# EasyEDA Pro project DRV8701E_V1.0.eprj

# Schematic DRV8701E
Create Date: 2023-04-21; Page Name: P1; Project Name: DRV8701E_V1.0; Schematic Name: DRV8701E; Update Date: 2023-04-21; Company: 嘉立创EDA; Page Size: A4; Version: V1.0
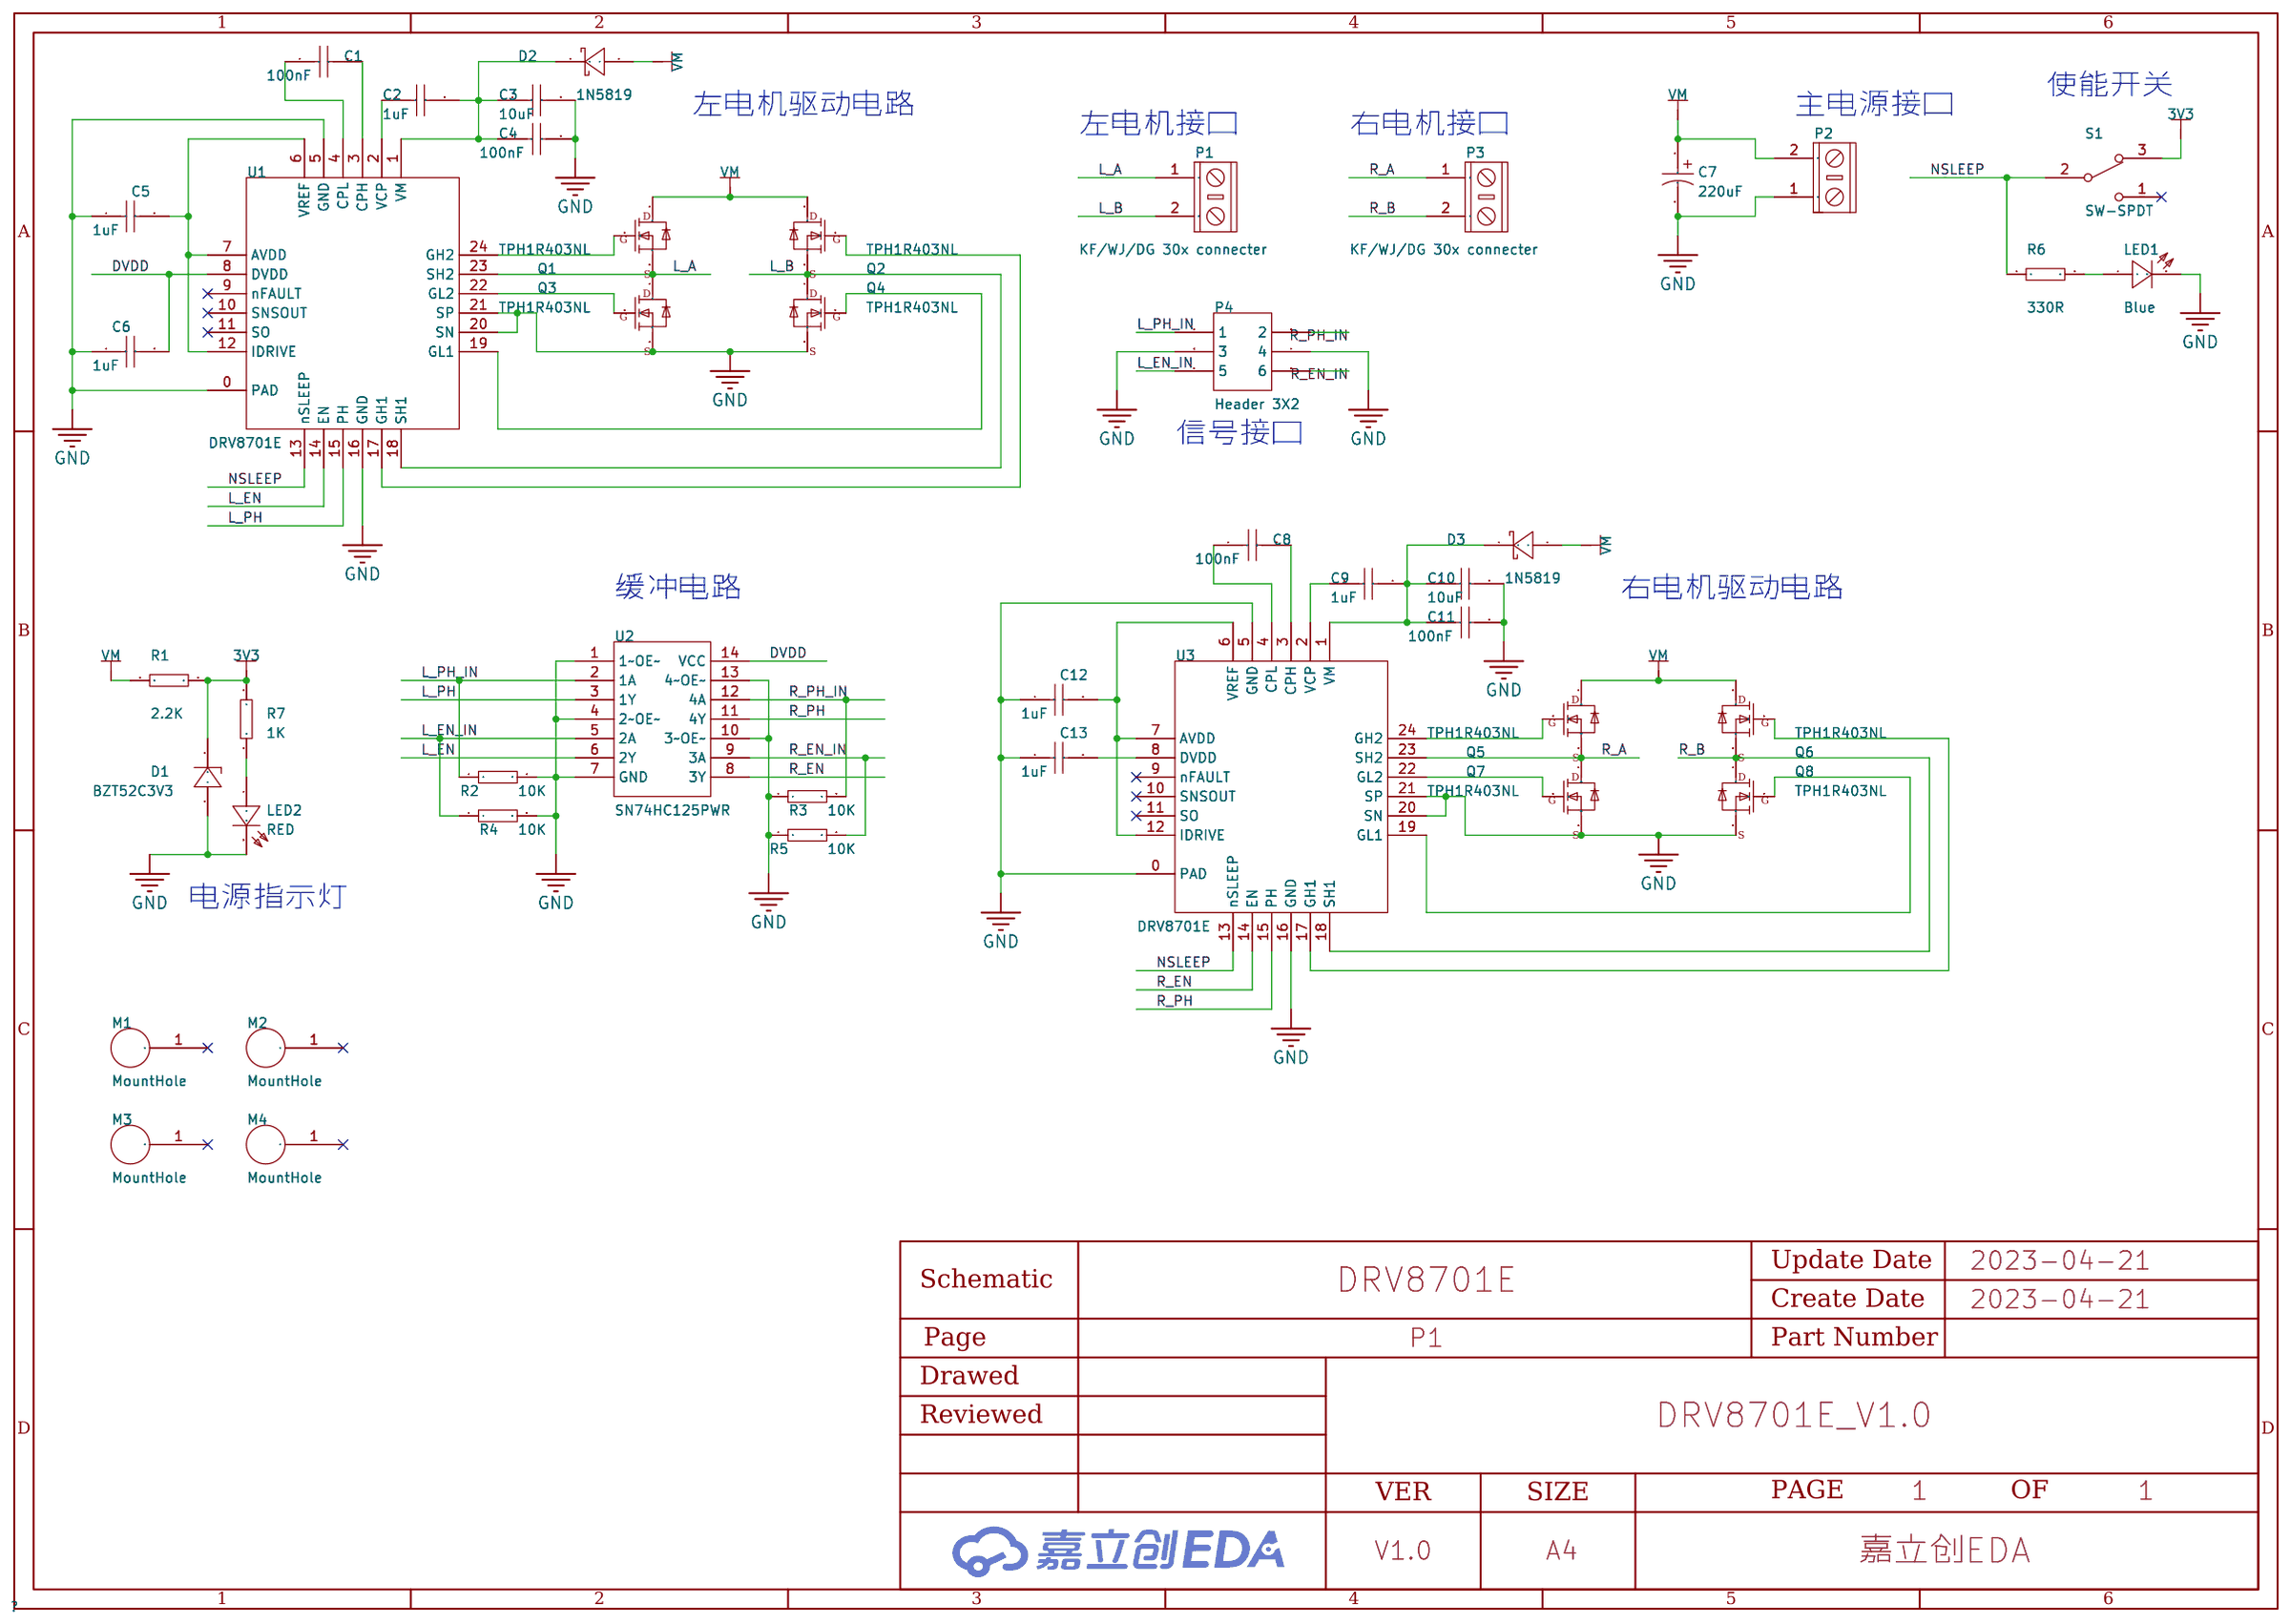
[diagram p0: schematic sheet]

## Parts
C1  100nF  [CAPC1608[0603]S-N]
C2  1uF  [CAPC1608[0603]S-N]
C3  10uF  [CAPC2012[0805]S-N]
C4  100nF  [CAPC1608[0603]S-N]
C5  1uF  [CAPC1608[0603]S-N]
C6  1uF  [CAPC1608[0603]S-N]
C7  220uF  [CAPPR3.5-8X11.5]
C8  100nF  [CAPC1608[0603]S-N]
C9  1uF  [CAPC1608[0603]S-N]
C10  10uF  [CAPC2012[0805]S-N]
C11  100nF  [CAPC1608[0603]S-N]
C12  1uF  [CAPC1608[0603]S-N]
C13  1uF  [CAPC1608[0603]S-N]
D1  BZT52C3V3  [SOD-123-L]
D2  1N5819  [SOD-123-L]
D3  1N5819  [SOD-123-L]
LED1  Blue  [LEDC1608(0603)]
LED2  RED  [LEDC1608(0603)]
M1  MountHole  [M3-MountSlot]
M2  MountHole  [M3-MountSlot]
M3  MountHole  [M3-MountSlot]
M4  MountHole  [M3-MountSlot]
P1  KF/WJ/DG 30x connecter  [KF/WJ/DG 301-2p-5.0mm]
P2  KF/WJ/DG 30x connecter  [KF/WJ/DG 301-2p-5.0mm]
P3  KF/WJ/DG 30x connecter  [KF/WJ/DG 301-2p-5.0mm]
P4  Header 3X2  [HDR2X3]
Q1  TPH1R403NL  [DFN5x6]
Q2  TPH1R403NL  [DFN5x6]
Q3  TPH1R403NL  [DFN5x6]
Q4  TPH1R403NL  [DFN5x6]
Q5  TPH1R403NL  [DFN5x6]
Q6  TPH1R403NL  [DFN5x6]
Q7  TPH1R403NL  [DFN5x6]
Q8  TPH1R403NL  [DFN5x6]
R1  2.2K  [RESC1608[0603]S-N]
R2  10K  [RESC1608[0603]S-N]
R3  10K  [RESC1608[0603]S-N]
R4  10K  [RESC1608[0603]S-N]
R5  10K  [RESC1608[0603]S-N]
R6  330R  [RESC1608[0603]S-N]
R7  1K  [RESC1608[0603]S-N]
S1  SW-SPDT  [SS12D10]
U1  DRV8701E  [QFN24-4x4]
U2  SN74HC125PWR  [TSSOP-14]
U3  DRV8701E  [QFN24-4x4]

## Library data of the parts
C1 C4 C8 C11 = Cap-Chip_1: Published: 8-Jun-2000; Revision: July-2002: Re-released for DXP Platform.; Publisher: Altium Limited; Price(RMB): 0.000; Voltage: 50V; Tolerance: ±10%; Origin Footprint 2: CAPC1310[0504]S; Origin Footprint 3: CAPC3216[1206]S; Origin Footprint 4: CAPC3225[1210]S; Origin Footprint 5: CAPC4532[1812]S; Origin Footprint 6: CAPC4564[1825]S; Origin Footprint 7: CAPC2012[0805]; Origin Footprint 8: CAPC3216[1206]; Origin Footprint 9: CAPC3225[1210]; Origin Footprint 10: CAPC4532[1812]; Origin Footprint 11: CAPC4564[1825]; Origin Footprint 12: CAPC1608[0603]-N; Origin Footprint 13: CAPC1608[0603]-L; Origin Footprint 14: CAPC1608[0603]-M; Origin Footprint 15: CAPC1608[0603]S-L; Origin Footprint 16: CAPC1608[0603]S-M; Origin Footprint 17: CAPC1005[0402]-L; Origin Footprint 18: CAPC1005[0402]-M; Origin Footprint 19: CAPC1005[0402]-N; Origin Footprint 20: CAPC1005[0402]S-L; Origin Footprint 21: CAPC1005[0402]S-M; Origin Footprint 22: CAPC1005[0402]S-N; Origin Footprint 23: CAPC2012[0805]S-L; Origin Footprint 24: CAPC2012[0805]S-M; Origin Footprint 25: CAPC2012[0805]S-N
C2 C5 C6 C9 C12 C13 = Cap-Chip_2: Published: 8-Jun-2000; Revision: July-2002: Re-released for DXP Platform.; Publisher: Altium Limited; Price(RMB): 0.000; Voltage: 25V; Tolerance: ±10%; Origin Footprint 2: CAPC1310[0504]S; Origin Footprint 3: CAPC3216[1206]S; Origin Footprint 4: CAPC3225[1210]S; Origin Footprint 5: CAPC4532[1812]S; Origin Footprint 6: CAPC4564[1825]S; Origin Footprint 7: CAPC2012[0805]; Origin Footprint 8: CAPC3216[1206]; Origin Footprint 9: CAPC3225[1210]; Origin Footprint 10: CAPC4532[1812]; Origin Footprint 11: CAPC4564[1825]; Origin Footprint 12: CAPC1608[0603]-N; Origin Footprint 13: CAPC1608[0603]-L; Origin Footprint 14: CAPC1608[0603]-M; Origin Footprint 15: CAPC1608[0603]S-L; Origin Footprint 16: CAPC1608[0603]S-M; Origin Footprint 17: CAPC1005[0402]-L; Origin Footprint 18: CAPC1005[0402]-M; Origin Footprint 19: CAPC1005[0402]-N; Origin Footprint 20: CAPC1005[0402]S-L; Origin Footprint 21: CAPC1005[0402]S-M; Origin Footprint 22: CAPC1005[0402]S-N; Origin Footprint 23: CAPC2012[0805]S-L; Origin Footprint 24: CAPC2012[0805]S-M; Origin Footprint 25: CAPC2012[0805]S-N
C3 C10 = Cap-Chip: Published: 8-Jun-2000; Revision: July-2002: Re-released for DXP Platform.; Publisher: Altium Limited; Price(RMB): 0.000; Voltage: 25V; Tolerance: ±10%; Origin Footprint 2: CAPC1310[0504]S; Origin Footprint 3: CAPC3216[1206]S; Origin Footprint 4: CAPC3225[1210]S; Origin Footprint 5: CAPC4532[1812]S; Origin Footprint 6: CAPC4564[1825]S; Origin Footprint 7: CAPC2012[0805]; Origin Footprint 8: CAPC3216[1206]; Origin Footprint 9: CAPC3225[1210]; Origin Footprint 10: CAPC4532[1812]; Origin Footprint 11: CAPC4564[1825]; Origin Footprint 12: CAPC1608[0603]-N; Origin Footprint 13: CAPC1608[0603]-L; Origin Footprint 14: CAPC1608[0603]-M; Origin Footprint 15: CAPC1608[0603]S-L; Origin Footprint 16: CAPC1608[0603]S-M; Origin Footprint 17: CAPC1608[0603]S-N; Origin Footprint 18: CAPC1005[0402]-L; Origin Footprint 19: CAPC1005[0402]-M; Origin Footprint 20: CAPC1005[0402]-N; Origin Footprint 21: CAPC1005[0402]S-L; Origin Footprint 22: CAPC1005[0402]S-M; Origin Footprint 23: CAPC1005[0402]S-N; Origin Footprint 24: CAPC2012[0805]S-L; Origin Footprint 25: CAPC2012[0805]S-M
C7 = Cap-Elect: Published: 8-Jun-2000; Revision: July-2002: Re-released for DXP Platform.; Publisher: Altium Limited; Price(RMB): 0.000; Voltage: 25V; Origin Footprint 2: CAPPR2-4x6.8; Origin Footprint 3: CAPPR2-5X5; Origin Footprint 4: CAPPR2-5X6.8; Origin Footprint 5: CAPPR2-5X7; Origin Footprint 6: CAPPR2-5X11; Origin Footprint 7: CAPPR2-5X11.5; Origin Footprint 8: CAPPR2-5X15; Origin Footprint 9: CAPPR2.5-6.3X5; Origin Footprint 10: CAPPR2.5-6.3X5/h.9; Origin Footprint 11: CAPPR2.5-6.3X6.8; Origin Footprint 12: CAPPR2.5-6.3X6.8/h.9; Origin Footprint 13: CAPPR2.5-6.3X7; Origin Footprint 14: CAPPR2.5-6.3X11; Origin Footprint 15: CAPPR2.5-6.3X11.5; Origin Footprint 16: CAPPR2.5-6.3X15; Origin Footprint 17: CAPPR2.5-6.3x9.8; Origin Footprint 18: CAPPR2.5-8X9.8; Origin Footprint 19: CAPPR2.5-8X11; Origin Footprint 20: CAPPR2.5-8x5; Origin Footprint 21: CAPPR3.05-3.81X6.35; Origin Footprint 22: CAPPR3.5-8X5/h.9; Origin Footprint 23: CAPPR3.5-8X10.5; Origin Footprint 24: CAPPR3.5-8X12; Origin Footprint 25: CAPPR3.5-8X15; Origin Footprint 26: CAPPR3.5-8X20; Origin Footprint 27: CAPPR3.5-8x5; Origin Footprint 28: CAPPR5-8X5; Origin Footprint 29: CAPPR5-8X11.5; Origin Footprint 30: CAPPR5-8X12; Origin Footprint 31: CAPPR5-8X15; Origin Footprint 32: CAPPR5-8X20; Origin Footprint 33: CAPPR5-10X5/H.9; Origin Footprint 34: CAPPR5-10X10.5; Origin Footprint 35: CAPPR5-10X12.5; Origin Footprint 36: CAPPR5-10X16; Origin Footprint 37: CAPPR5-10X20/H1.1; Origin Footprint 38: CAPPR5-10X25; Origin Footprint 39: CAPPR5-10X30; Origin Footprint 40: CAPPR5-10x5; Origin Footprint 41: CAPPR5-10x20; Origin Footprint 42: CAPPR2.5-6.3X6.8-L
D1 = Diode Zen: Published: 8-Jun-2000; Revision: July-2002: Re-released for DXP Platform.; Publisher: Altium Limited; Price(RMB): 0.000; Origin Footprint 2: DIODE-0.7; Origin Footprint 3: DIODE-0.4; Origin Footprint 4: SOD-87[LL-41]; Origin Footprint 5: CD4521-1808; Origin Footprint 6: SOD-80[LL-34]
D2 D3 = Diode Schottky: Published: 8-Jun-2000; Revision: July-2002: Re-released for DXP Platform.; Publisher: Altium Limited; Price(RMB): 0.000; Imax: 500mA; Origin Footprint 2: SMB[DO-214AA]; Origin Footprint 3: SMC[DO-214AB]; Origin Footprint 4: SOD-123; Origin Footprint 5: SOD-323; Origin Footprint 6: SOD-523; Origin Footprint 7: SMA[DO-214AC]; Origin Footprint 8: SOD-523-L
LED1 = LED Chip Blue: Published: 8-Jun-2000; Revision: July-2002: Re-released for DXP Platform.; Publisher: Altium Limited; Price(RMB): 0.00; Origin Footprint 2: LEDC2012(0805); Origin Footprint 3: LEDC3216(1206)
LED2 = LED Chip Red: Published: 8-Jun-2000; Revision: July-2002: Re-released for DXP Platform.; Publisher: Altium Limited; Price(RMB): 0.00; Origin Footprint 2: LEDC2012(0805); Origin Footprint 3: LEDC3216(1206)
M1-M4 = MountHole: Origin Footprint 2: M3-MountHole
P1-P3 = KF/WJ/DG 30x
P4 = Header 3X2: LatestRevisionDate: 17-Jul-2002; LatestRevisionNote: Re-released for DXP Platform.; Publisher: Altium Limited; Price(RMB): 0.00; Origin Footprint 2: HDR2X3-M-SMT
Q1-Q8 = TPH1R403NL
R1 = Res-Chip: Published: 8-Jun-2000; Revision: July-2002: Re-released for DXP Platform.; Publisher: Altium Limited; Price(RMB): 0.000; Tolerance: ±1%; Origin Footprint 2: RESC2012[0805]S; Origin Footprint 3: RESC3216[1206]S; Origin Footprint 4: RESC3225[1210]S; Origin Footprint 5: RESC5025[2010]S; Origin Footprint 6: RESC6332[2512]S; Origin Footprint 7: RESC5025[2010]; Origin Footprint 8: RESC6332[2512]; Origin Footprint 9: RESC3225[1210]; Origin Footprint 10: RESC3216[1206]; Origin Footprint 11: RESC2012[0805]; Origin Footprint 12: RESC1608[0603]-M; Origin Footprint 13: RESC1608[0603]-L; Origin Footprint 14: RESC1608[0603]-N; Origin Footprint 15: RESC1608[0603]S-L; Origin Footprint 16: RESC1608[0603]S-M; Origin Footprint 17: RESC1005[0402]-L; Origin Footprint 18: RESC1005[0402]-N; Origin Footprint 19: RESC1005[0402]-M; Origin Footprint 20: RESC1005[0402]S-L; Origin Footprint 21: RESC1005[0402]S-M; Origin Footprint 22: RESC1005[0402]S-N
R2-R5 = Res-Chip_1: Published: 8-Jun-2000; Revision: July-2002: Re-released for DXP Platform.; Publisher: Altium Limited; Price(RMB): 0.000; Tolerance: ±1%; Origin Footprint 2: RESC2012[0805]S; Origin Footprint 3: RESC3216[1206]S; Origin Footprint 4: RESC3225[1210]S; Origin Footprint 5: RESC5025[2010]S; Origin Footprint 6: RESC6332[2512]S; Origin Footprint 7: RESC5025[2010]; Origin Footprint 8: RESC6332[2512]; Origin Footprint 9: RESC3225[1210]; Origin Footprint 10: RESC3216[1206]; Origin Footprint 11: RESC2012[0805]; Origin Footprint 12: RESC1608[0603]-M; Origin Footprint 13: RESC1608[0603]-L; Origin Footprint 14: RESC1608[0603]-N; Origin Footprint 15: RESC1608[0603]S-L; Origin Footprint 16: RESC1608[0603]S-M; Origin Footprint 17: RESC1005[0402]-L; Origin Footprint 18: RESC1005[0402]-N; Origin Footprint 19: RESC1005[0402]-M; Origin Footprint 20: RESC1005[0402]S-L; Origin Footprint 21: RESC1005[0402]S-M; Origin Footprint 22: RESC1005[0402]S-N
R6 = Res-Chip_3: Published: 8-Jun-2000; Revision: July-2002: Re-released for DXP Platform.; Publisher: Altium Limited; Price(RMB): 0.000; Tolerance: ±1%; Origin Footprint 2: RESC2012[0805]S; Origin Footprint 3: RESC3216[1206]S; Origin Footprint 4: RESC3225[1210]S; Origin Footprint 5: RESC5025[2010]S; Origin Footprint 6: RESC6332[2512]S; Origin Footprint 7: RESC5025[2010]; Origin Footprint 8: RESC6332[2512]; Origin Footprint 9: RESC3225[1210]; Origin Footprint 10: RESC3216[1206]; Origin Footprint 11: RESC2012[0805]; Origin Footprint 12: RESC1608[0603]-M; Origin Footprint 13: RESC1608[0603]-L; Origin Footprint 14: RESC1608[0603]-N; Origin Footprint 15: RESC1608[0603]S-L; Origin Footprint 16: RESC1608[0603]S-M; Origin Footprint 17: RESC1005[0402]-L; Origin Footprint 18: RESC1005[0402]-N; Origin Footprint 19: RESC1005[0402]-M; Origin Footprint 20: RESC1005[0402]S-L; Origin Footprint 21: RESC1005[0402]S-M; Origin Footprint 22: RESC1005[0402]S-N
R7 = Res-Chip_2: Published: 8-Jun-2000; Revision: July-2002: Re-released for DXP Platform.; Publisher: Altium Limited; Price(RMB): 0.000; Tolerance: ±1%; Origin Footprint 2: RESC2012[0805]S; Origin Footprint 3: RESC3216[1206]S; Origin Footprint 4: RESC3225[1210]S; Origin Footprint 5: RESC5025[2010]S; Origin Footprint 6: RESC6332[2512]S; Origin Footprint 7: RESC5025[2010]; Origin Footprint 8: RESC6332[2512]; Origin Footprint 9: RESC3225[1210]; Origin Footprint 10: RESC3216[1206]; Origin Footprint 11: RESC2012[0805]; Origin Footprint 12: RESC1608[0603]-M; Origin Footprint 13: RESC1608[0603]-L; Origin Footprint 14: RESC1608[0603]-N; Origin Footprint 15: RESC1608[0603]S-L; Origin Footprint 16: RESC1608[0603]S-M; Origin Footprint 17: RESC1005[0402]-L; Origin Footprint 18: RESC1005[0402]-N; Origin Footprint 19: RESC1005[0402]-M; Origin Footprint 20: RESC1005[0402]S-L; Origin Footprint 21: RESC1005[0402]S-M; Origin Footprint 22: RESC1005[0402]S-N
S1 = SW-SPDT: Published: 24-Mar-1999; Publisher: Altium Limited; Price(RMB): 0.000; Origin Footprint 2: ToggleSwitch 7102; Origin Footprint 3: SS12D06
U1 U3 = DRV8701E
U2 = SN74HC125PWR

## Nets
3V3: D1.K R1.2 R7.1 S1.3
DVDD: C6.2 U1.8(DVDD) U2.14(VCC)
GND: C3.2 C4.2 C5.1 C6.1 C7.2 C10.2 C11.2 C12.1 C13.1 D1.A LED1.C LED2.C P2.1 P4.3 P4.4 Q3.3(S) Q4.3(S) Q7.3(S) Q8.3(S) R2.2 R3.1 R4.2 R5.1 U1.0(PAD) U1.5(GND) U1.16(GND) U1.20(SN) U1.21(SP) U2.1(1~OE~) U2.4(2~OE~) U2.7(GND) U2.10(3~OE~) U2.13(4~OE~) U3.0(PAD) U3.5(GND) U3.16(GND) U3.20(SN) U3.21(SP)
L_A: P1.1 Q1.3(S) Q3.1(D) U1.23(SH2)
L_B: P1.2 Q2.3(S) Q4.1(D) U1.18(SH1)
L_EN: U1.14(EN) U2.6(2Y)
L_EN_IN: P4.5 R4.1 U2.5(2A)
L_PH: U1.15(PH) U2.3(1Y)
L_PH_IN: P4.1 R2.1 U2.2(1A)
NSLEEP: R6.1 S1.2 U1.13(nSLEEP) U3.13(nSLEEP)
R_A: P3.1 Q5.3(S) Q7.1(D) U3.23(SH2)
R_B: P3.2 Q6.3(S) Q8.1(D) U3.18(SH1)
R_EN: U2.8(3Y) U3.14(EN)
R_EN_IN: P4.6 R5.2 U2.9(3A)
R_PH: U2.11(4Y) U3.15(PH)
R_PH_IN: P4.2 R3.2 U2.12(4A)
VM: C7.1 D2.A D3.A P2.2 Q1.1(D) Q2.1(D) Q5.1(D) Q6.1(D) R1.1
$1N572: C5.2 U1.6(VREF) U1.7(AVDD) U1.12(IDRIVE)
$1N573: C1.1 U1.4(CPL)
$1N574: C1.2 U1.3(CPH)
$1N575: C2.1 U1.2(VCP)
$1N583: Q1.2(G) U1.24(GH2)
$1N584: Q3.2(G) U1.22(GL2)
$1N591: Q4.2(G) U1.19(GL1)
$1N592: Q2.2(G) U1.17(GH1)
$1N595: C2.2 C3.1 C4.1 D2.K U1.1(VM)
$1N919: LED1.A R6.2
$1N1087: LED2.A R7.2
$1N1891: C13.2 U3.8(DVDD)
$1N1892: C12.2 U3.6(VREF) U3.7(AVDD) U3.12(IDRIVE)
$1N1893: C8.1 U3.4(CPL)
$1N1894: C9.1 U3.2(VCP)
$1N1896: C9.2 C10.1 C11.1 D3.K U3.1(VM)
$1N1905: Q5.2(G) U3.24(GH2)
$1N1906: Q7.2(G) U3.22(GL2)
$1N1913: Q8.2(G) U3.19(GL1)
$1N1914: Q6.2(G) U3.17(GH1)
$1N1915: C8.2 U3.3(CPH)

Not connected (* = marked no-connect by the designer): M1 1*; M2 1*; M3 1*; M4 1*; S1 1*; U1 9(nFAULT)* 10(SNSOUT)* 11(SO)*; U3 9(nFAULT)* 10(SNSOUT)* 11(SO)*

## Notes on the sheet
- 使能开关
- 左电机驱动电路
- 主电源接口
- 左电机接口
- 右电机接口
- 信号接口
- 缓冲电路
- 右电机驱动电路
- 电源指示灯

# Board DRV8701E
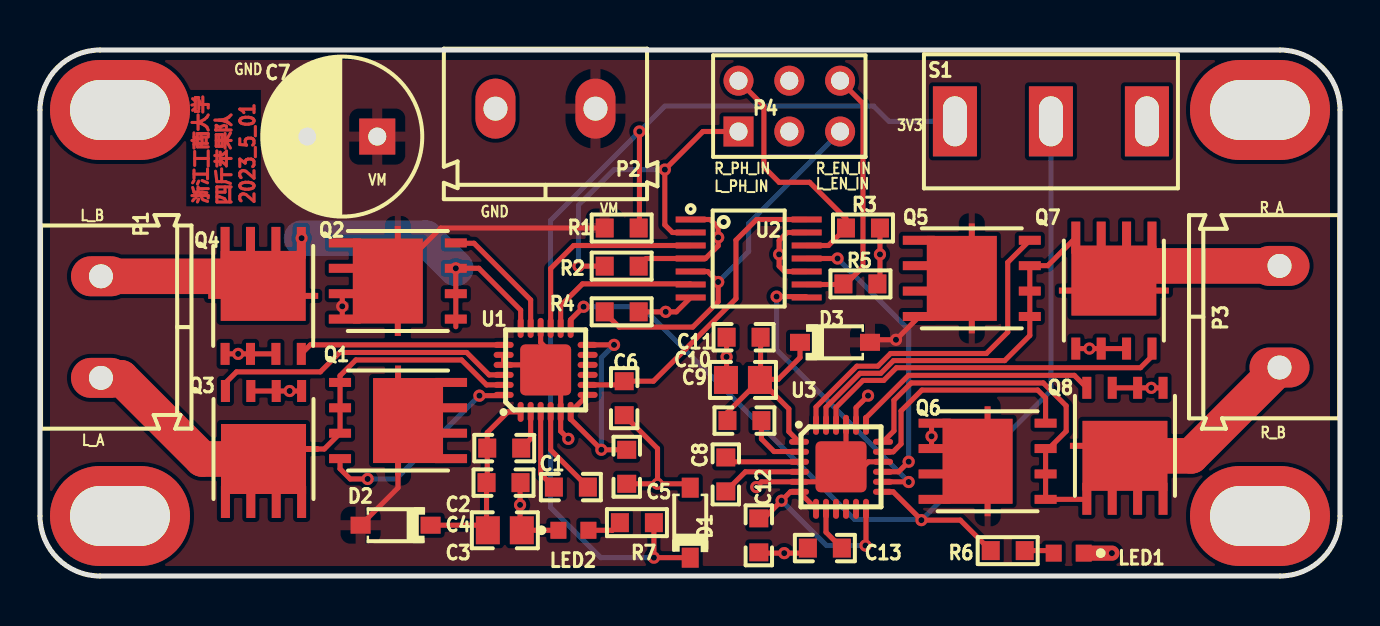
[diagram p1: board, top side]
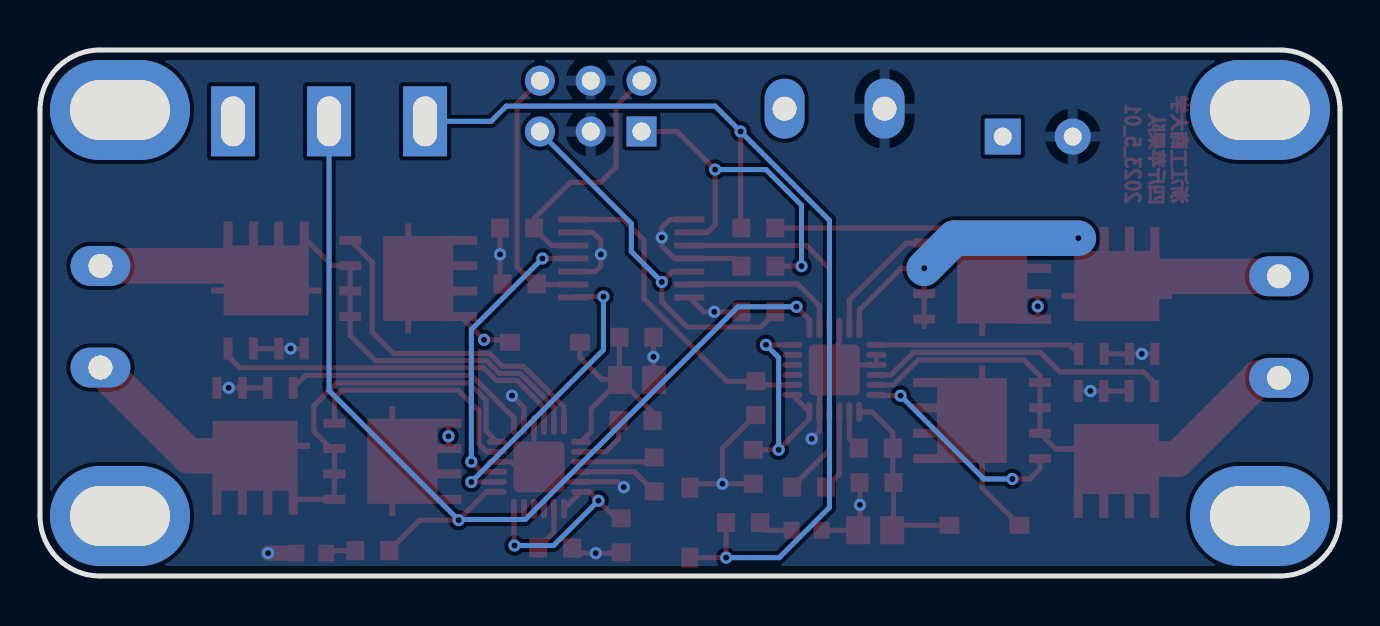
[diagram p2: board, bottom side, seen from below]

Outline 65 x 26.3 mm; copper layers: Top Layer, Bottom Layer. Coordinates in mm from the lower left corner of the outline.
Outline path: 0,23.3 0,3 arc(0.88,0.88) 3,0 62,0 arc(64.12,0.88) 65,3 65,23.3 arc(64.12,25.42) 62,26.3 3,26.3 arc(0.88,25.42) 0,23.3
Stack: Top Layer 0.035mm / Dielectric1 1.51mm FR4 er 4.5 / Bottom Layer 0.035mm

## Design rules (mm)
template: JLCPCB Capability(Two Layers Board)
spacing copperThickness1oz (default): track to track 0.102, other pairs 0.152 to 0.3
spacing copperThickness2oz: track to track 0.203, other pairs 0.152 to 0.3
track width copperThickness1oz (default): min 0.127, default 0.254, max 2.54
track width copperThickness2oz: min 0.203, default 0.254, max 2.54
differential pair differentialPair (default): width min 0.127, default 0.254, max 2.54; gap min 0.152, default 0.152
via viaSize (default): diameter min 0.5, default 0.61, max 10; hole min 0.3, default 0.305, max 6.3

## Placement (name value [footprint] x y rotation side)
C1  100nF  [CAPC1608[0603]S-N]  26.54 4.44 180 top
C2  1uF  [CAPC1608[0603]S-N]  23.21 6.39 180 top
C3  10uF  [CAPC2012[0805]S-N]  23.24 2.29 0 top
C4  100nF  [CAPC1608[0603]S-N]  23.18 4.67 0 top
C5  1uF  [CAPC1608[0603]S-N]  29.34 5.46 90 top
C6  1uF  [CAPC1608[0603]S-N]  29.21 8.89 90 top
C7  220uF  [CAPPR3.5-8X11.5]  15.11 21.97 180 top
C8  100nF  [CAPC1608[0603]S-N]  34.29 5.08 90 top
C9  1uF  [CAPC1608[0603]S-N]  35.22 7.77 180 top
C10  10uF  [CAPC2012[0805]S-N]  35.15 9.8 180 top
C11  100nF  [CAPC1608[0603]S-N]  35.18 11.94 180 top
C12  1uF  [CAPC1608[0603]S-N]  35.94 2.03 90 top
C13  1uF  [CAPC1608[0603]S-N]  39.24 1.4 0 top
D1  BZT52C3V3  [SOD-123-L]  32.51 2.67 270 top
D2  1N5819  [SOD-123-L]  17.78 2.54 0 top
D3  1N5819  [SOD-123-L]  39.75 11.68 180 top
LED1  Blue  [LEDC1608(0603)]  51.44 1.14 180 top
LED2  RED  [LEDC1608(0603)]  26.67 2.29 0 top
M1  MountHole  [M3-MountSlot]  3.56 22.72 0 top
M2  MountHole  [M3-MountSlot]  60.56 2.42 0 top
M3  MountHole  [M3-MountSlot]  3.56 2.42 0 top
M4  MountHole  [M3-MountSlot]  60.56 22.72 0 top
P1  KF/WJ/DG 30x connecter  [KF/WJ/DG 301-2p-5.0mm]  3.05 12.45 270 top
P2  KF/WJ/DG 30x connecter  [KF/WJ/DG 301-2p-5.0mm#2]  25.27 23.37 180 top
P3  KF/WJ/DG 30x connecter  [KF/WJ/DG 301-2p-5.0mm]  61.98 12.96 90 top
P4  Header 3X2  [HDR2X3]  34.93 22.22 0 top
Q1  TPH1R403NL  [DFN5x6]  17.9 7.77 270 top
Q2  TPH1R403NL  [DFN5x6]  17.89 14.75 90 top
Q3  TPH1R403NL  [DFN5x6]  11.18 6.35 180 top
Q4  TPH1R403NL  [DFN5x6]  11.16 14 0 top
Q5  TPH1R403NL  [DFN5x6]  46.59 14.88 90 top
Q6  TPH1R403NL  [DFN5x6]  47.38 5.74 90 top
Q7  TPH1R403NL  [DFN5x6]  53.69 14.27 0 top
Q8  TPH1R403NL  [DFN5x6]  54.25 6.51 180 top
R1  2.2K  [RESC1608[0603]S-N]  29.08 17.4 0 top
R2  10K  [RESC1608[0603]S-N]  29.08 15.49 0 top
R3  10K  [RESC1608[0603]S-N]  41.15 17.4 180 top
R4  10K  [RESC1608[0603]S-N]  29.08 13.21 0 top
R5  10K  [RESC1608[0603]S-N]  41.02 14.61 180 top
R6  330R  [RESC1608[0603]S-N]  48.39 1.27 0 top
R7  1K  [RESC1608[0603]S-N]  29.84 2.67 180 top
S1  SW-SPDT  [SS12D10]  50.55 22.73 180 top
U1  DRV8701E  [QFN24-4x4]  25.28 10.31 90 top
U2  SN74HC125PWR  [TSSOP-14]  35.43 15.88 0 top
U3  DRV8701E  [QFN24-4x4]  40.05 5.46 0 top

## Footprints (pads in the part's own frame, mm; a bottom-side part is the same pattern mirrored in y, then rotated)
CAPC1608[0603]S-N
  rect 0.9x0.95 smd: 1(-0.85,0) 2(0.85,0)
CAPC2012[0805]S-N
  rect 1.2x1.4 smd: 1(-0.85,0) 2(0.85,0)
CAPPR3.5-8X11.5
  rect 1.8x1.8 hole 0.9: 1(-1.75,0)
  round 1.8 hole 0.9: 2(1.75,0)
DFN5x6
  rect 0.45x1.6 smd: 1(-1.905,2.65) 1(-0.635,2.65) 1(0.635,2.65) 1(1.905,2.65)
  rect 4.25x3.5 smd: 1(0,0.5)
  rect 5.5x0.3 smd: 1(0,0)
  rect 0.45x1.1 smd: 2(1.905,-2.9) 3(-1.905,-2.9) 3(-0.635,-2.9) 3(0.635,-2.9)
HDR2X3
  rect 1.5x1.5 hole 0.9: 1(0,0)
  round 1.5 hole 0.9: 2(0,2.54) 3(2.54,0) 4(2.54,2.54) 5(5.08,0) 6(5.08,2.54)
KF/WJ/DG 301-2p-5.0mm
  oval 2x3 hole 1.2: 1(2.54,0) 2(-2.54,0)
KF/WJ/DG 301-2p-5.0mm#2
  oval 2x3 hole 1.2: 1(2.5,0) 2(-2.5,0)
LEDC1608(0603)
  rect 0.8x0.85 smd: A(0.75,0) C(-0.75,0)
M3-MountSlot
  oval 7x5 hole 5x3: 1(0.436,0.579)
QFN24-4x4
  rrect 2.55x2.55 smd: 0(0,0)
  oval 1x0.3 smd: 1(-2.1,1.25) 2(-2.1,0.75) 3(-2.1,0.25) 4(-2.1,-0.25) 5(-2.1,-0.75) 6(-2.1,-1.25) 13(2.1,-1.25) 14(2.1,-0.75) 15(2.1,-0.25) 16(2.1,0.25) 17(2.1,0.75) 18(2.1,1.25)
  oval 0.3x1 smd: 7(-1.25,-2.1) 8(-0.75,-2.1) 9(-0.25,-2.1) 10(0.25,-2.1) 11(0.75,-2.1) 12(1.25,-2.1) 19(1.25,2.1) 20(0.75,2.1) 21(0.25,2.1) 22(-0.25,2.1) 23(-0.75,2.1) 24(-1.25,2.1)
RESC1608[0603]S-N
  rect 0.9x0.95 smd: 1(-0.85,0) 2(0.85,0)
SOD-123-L
  rect 1x0.85 smd: A(-1.75,0) K(1.75,0)
SS12D10
  rect 2.2x3.5 hole 1.2x2.5: 1(-4.8,0) 2(0,0) 3(4.8,0)
TSSOP-14
  rect 1.5x0.3 smd: 1(-2.9,1.95) 2(-2.9,1.3) 3(-2.9,0.65) 4(-2.9,0) 5(-2.9,-0.65) 6(-2.9,-1.3) 7(-2.9,-1.95) 8(2.9,-1.95) 9(2.9,-1.3) 10(2.9,-0.65) 11(2.9,0) 12(2.9,0.65) 13(2.9,1.3) 14(2.9,1.95)

## Nets
As in the schematic.

Pads without a net: M1 1; M2 1; M3 1; M4 1; S1 1; U1 9 10 11; U3 9 10 11

## Via types
v1: diameter 0.61, hole 0.305, Top Layer to Bottom Layer, 38 vias

## Routing (per net, layer and track width the routed paths; a pad name or vN(x,y) marks a point on that pad's centre or on a via; arc(x,y) is an arc through that point)
3V3: length 51.9
  Top Layer w0.254: R1.2 29.97,17.44 v1(29.97,22.22) ; D1.K v1(30.69,0.92) R7.1
  Bottom Layer w0.254: S1.3 42.44,22.73 41.68,23.5 31.24,23.5 v1(29.97,22.22) 25.53,17.78 25.53,3.43 28.04,0.92 v1(30.69,0.92)
DVDD: length 16.1
  Top Layer w0.254: U2.14 35.83,17.83 34.8,16.79 34.8,13.86 30.67,9.74 C6.2 29.03,9.56 U1.8
GND: length 64.4
  Top Layer w0.254: U1.20 U1.21 25.03,10.56 U1.0 ; Q3.3 v1(12.48,9.25) Q3.3 ; U2.1 33.51,17.83 33.91,17.43 v1(33.91,16.93) 33.91,16.51 33.27,15.88 U2.4 30.31,15.88 R2.2 ; U2.13 37.35,17.17 36.96,16.78 v1(36.96,16.08) 36.96,15.49 37.23,15.22 U2.10 ; D1.A 32.32,4.61 v1(30.88,4.61) ; 35.94,1.31 36.11,1.14 v1(37.21,1.14) 38.14,1.14 C13.1 ; U1.0 26.03,9.56 26.03,7.24 v1(26.42,6.86) ; U1.0 25.28,11.43 25.03,11.68 U1.16 ; C4.2 24,4.65 v1(24,3.56) 24,2.37 C3.2 LED2.C ; U3.0 40.3,5.71 U3.21 ; U3.0 39.3,4.71 U3.5 36.08,4.71 v1(35.81,4.44) ; U3.0 41.17,5.46 41.42,5.71 42.15,5.71 ; v1(41.4,9.02) 40.8,8.42 U3.20 ; 42,14.61 v1(42,16.08) R3.1 ; C10.2 34.33,9.83 v1(34.33,10.96) C11.2 ; Q7.3 v1(52.47,11.37) Q7.3 Q7.3 ; C6.1 30.88,6.37 v1(30.88,4.61) ; Q4.3 v1(9.91,11.11) Q4.3 Q4.3 ; Q8.3 v1(55.56,9.41) Q8.3 Q8.3 ; U2.7 31.82,13.21 v1(31.29,13.21) R4.2 ; v1(30.88,4.61) C5.1
  Top Layer w0.762: LED1.C v1(53.59,1.14)
L_A: length 26.1
  Top Layer w0.254: Q3.1 11.68,6.35 14.21,6.35 Q1.3 Q1.3 Q1.3 15,10.01 15.79,10.8 21.08,10.8 22.33,9.56 U1.23
  Top Layer w1.778: Q3.1 8.11,5.85 4.06,9.91 P1.1
L_B: length 24.6
  Top Layer w0.254: 20.83,15.39 v1(20.79,15.39) ; 20.83,15.39 21.94,15.39 24.03,13.29 U1.18 ; 20.83,15.39 20.81,15.37 v1(20.79,15.39) ; v1(20.79,15.39) Q2.3 Q2.3 20.79,12.46
  Top Layer w1.778: Q4.1 10.68,14.99 P1.2
  Bottom Layer w1.778: v1(13.08,16.89) 19.28,16.89 v1(20.79,15.39)
L_EN: length 8.1
  Top Layer w0.254: U2.6 32.5,14.61 27.12,14.61 26.03,13.52 U1.14
L_EN_IN: length 19.2
  Top Layer w0.254: R4.1 28.23,13.17 28.96,12.45 32.64,12.45 33.91,13.72 v1(33.91,14.7) 33.38,15.22 U2.5
  Bottom Layer w0.254: v1(33.91,14.7) 35.43,16.22 35.43,17.62 40,22.19 40,22.22
L_PH: length 10.4
  Top Layer w0.254: U1.15 25.53,15.37 26.69,16.53 U2.3
L_PH_IN: length 18.1
  Top Layer w0.254: P4.1 33.15,22.22 v1(31.24,20.32) 31.24,17.56 31.62,17.17 U2.2 ; R2.1 v1(26.92,15.49)
  Bottom Layer w0.254: v1(31.24,20.32) 28.7,20.32 26.92,18.54 v1(26.92,15.49)
NSLEEP: length 51.9
  Top Layer w0.254: 42.15,4.21 42.66,4.21 44.07,2.8 v1(44.07,2.79) 46.01,2.79 R6.1 ; v1(27.18,13.46) 26.53,12.82 U1.13
  Bottom Layer w0.254: S1.2 50.55,9.27 v1(44.07,2.79) 44.04,2.83 40.74,2.83 30.1,13.46 v1(27.18,13.46)
R_A: length 27.5
  Top Layer w0.254: U3.23 39.3,8.44 41,10.14 42.04,10.14 42.67,10.77 48.23,10.77 49.49,12.03 Q5.3 Q5.3 Q5.3 50.38,15.52 Q7.1
  Top Layer w1.778: Q7.1 54.43,15.5 P3.1
R_B: length 28.6
  Top Layer w0.254: 42.15,6.71 42.7,7.26 42.7,8.79 43.56,9.65 50.16,9.65 51.31,8.51 51.31,7.24 50.44,6.37 Q6.3 Q6.3 Q6.3 52.32,3.83 Q8.1
  Top Layer w1.778: P3.2 57.56,6.01 Q8.1
R_EN: length 14.8
  Top Layer w0.254: U2.8 38.29,13.97 v1(36.83,13.97) ; 42.15,4.71 43.42,4.71 v1(43.43,4.7)
  Bottom Layer w0.254: v1(43.43,4.7) 36.83,11.3 v1(36.83,13.97)
R_EN_IN: length 13
  Top Layer w0.254: 40,24.77 41.15,23.62 41.15,15.45 40.27,14.58 U2.9
R_PH: length 14.7
  Top Layer w0.254: U2.11 v1(39.88,15.88) ; 42.15,5.21 42.93,5.21 v1(43.43,5.72)
  Bottom Layer w0.254: v1(43.43,5.72) 43.43,12.32 v1(39.88,15.88)
R_PH_IN: length 12.8
  Top Layer w0.254: P4.2 36.19,23.5 36.19,20.45 36.96,19.69 38.48,19.69 40.3,17.87 R3.2 39.42,16.53 U2.12
VM: length 23.7
  Top Layer w0.254: D2.A 17.9,4.41 Q1.1 ; R1.1 20.04,17.4 Q2.1 ; Q5.1 43.94,12.95 v1(42.8,11.81) 41.63,11.81 D3.A ; Q2.1 15.11,12.97 v1(15.11,13.48) 15.11,13.99 Q2.1 ; Q6.1 44.58,7.49 v1(44.58,6.98) 44.58,6.53 Q6.1
$1N572: length 11.8
  Top Layer w0.254: U1.7 26.53,8.2 26.53,7.85 v1(28.07,6.31) C5.2 ; v1(28.7,11.56) 27.38,11.56
  Bottom Layer w0.254: v1(28.07,6.31) 28.07,10.92 v1(28.7,11.56)
$1N573: length 4.5
  Top Layer w0.254: 25.53,8.2 25.53,6.31 C1.1
$1N574: length 4
  Top Layer w0.254: C1.2 25.03,5.11 25.03,8.2
$1N575: length 2
  Top Layer w0.254: C2.1 24.53,6.87 24.53,8.2
$1N583: length 10.6
  Top Layer w0.254: v1(16.38,4.85) 15.51,4.85 15,5.36 Q1.2 ; v1(21.97,9.02) 23.14,9.02 U1.24
  Bottom Layer w0.254: v1(16.38,4.85) 17.81,4.85 v1(21.97,9.02)
$1N584: length 15.4
  Top Layer w0.254: U1.22 22.45,10.06 21.33,11.18 14.99,11.18 14.02,10.21 9.82,10.21 9.27,9.65 Q3.2
$1N591: length 10.3
  Top Layer w0.254: Q4.2 13.51,11.56 U1.19
$1N592: length 6.3
  Top Layer w0.254: U1.17 24.53,13.81 21.7,16.64 20.81,16.64 Q2.2
$1N595: length 9.6
  Top Layer w0.254: D2.K 22.26,2.54 22.39,2.67 22.33,2.73 C4.1 22.36,4.7 C2.2 22.36,7.17 23.4,8.2 24.03,8.2
$1N919: length 1.5
  Top Layer w0.254: LED1.A 50.56,1.27 R6.2
$1N1087: length 1.7
  Top Layer w0.254: R7.2 28.61,2.29 LED2.A
$1N1891: length 2.3
  Top Layer w0.254: C13.2 39.3,2.19 U3.8
$1N1892: length 10.7
  Top Layer w0.254: C12.2 36.19,2.88 v1(37.08,3.77) 37.52,4.21 U3.6 U3.7 ; U3.12 41.3,1.55 v1(41.28,1.52)
  Bottom Layer w0.254: v1(41.28,1.52) 39.32,1.52 v1(37.08,3.77)
$1N1893: length 4.1
  Top Layer w0.254: C8.1 35.27,5.21 U3.4
$1N1894: length 3.1
  Top Layer w0.254: U3.2 37.94,6.22 36.7,6.22 36.07,6.85 C9.1
$1N1896: length 11.9
  Top Layer w0.254: C10.1 34.37,8.18 C9.2 ; C10.1 37.44,8.36 37.44,7.22 U3.1 ; C10.1 36.03,9.83 ; C11.1 36.03,9.83 ; 36.03,9.83 36.91,9.83 38,10.92 D3.K
$1N1905: length 17.1
  Top Layer w0.254: U3.24 38.8,8.45 40.84,10.49 41.89,10.49 42.53,11.12 47.32,11.12 48.39,12.19 48.39,15.68 Q5.2
$1N1906: length 18.1
  Top Layer w0.254: U3.22 39.8,8.43 41.15,9.78 42.19,9.78 42.82,10.41 55.02,10.41 55.6,10.99 Q7.2
$1N1913: length 12.5
  Top Layer w0.254: Q8.2 51.72,10.03 43.42,10.03 41.3,7.91 U3.19
$1N1914: length 11.8
  Top Layer w0.254: 42.15,6.21 42.66,6.21 43.05,6.6 43.05,8.25 44.09,9.3 49.89,9.3 50.28,8.9 Q6.2
$1N1915: length 3.8
  Top Layer w0.254: U3.3 34.51,5.71 C8.2

## Copper pours and planes (outline as drawn; the poured copper is in the pictures)
GND on Bottom Layer: -2.54,28.07 67.31,28.07 67.31,-8.51 -2.54,-8.51
VM on Top Layer: -2.16,29.08 67.69,29.08 67.69,-7.24 -2.16,-7.24

## Text on the board
Top Layer: 浙江工商大学 / 四斤苹果队 / 2023_5_01
Top Silkscreen Layer: L_B | L_A | GND | VM | R_PH_IN | L_PH_IN | R_EN_IN | L_EN_IN | 3V3 | R_A | R_B
